# Altium schematic sheet 02_Power_Budget.SchDoc
size A4; SheetNumber: 3; SheetTotal: 5
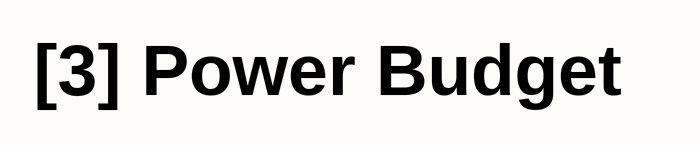
[diagram p0: 02_Power_Budget.SchDoc]

## Notes on the sheet
- [3] Power Budget